# EAGLE design rectifier (EAGLE 5.12)
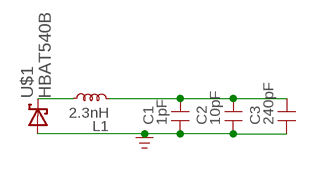
[diagram p0: schematic, sheet 1]

## Parts
C1  1pF  C-0805  [SMD0805]
C2  10pF  C-0805  [SMD0805]
C3  240pF  C-1210  [C1210]
L1  2.3nH  L-0402  [SMD0402]
U$1  HBAT540B  [SOT323]

## Nets
GND: C1.1 C2.1 C3.1 U$1.1(A)
N$1: L1.1 U$1.3(K)
N$2: C1.2 C2.2 C3.2 L1.2

## Library data of the parts
C1-C3 = c:C
L1 = l:L: Bournes SSR1806 Series From mouser: SRR1806-151M, 150uH, 1.05A, $0.85 Coiltronics DR127 Series From mouser: DR127-470-R, 47uH, 5.28A, $1.87 DR127-680-R, 68uH, 4.44A, $1.87 J.W. Miller 2300 Series From mouser: 2313, 120uH, 6.7A, $2.78
U$1 = siggen:HBAT540

## Board
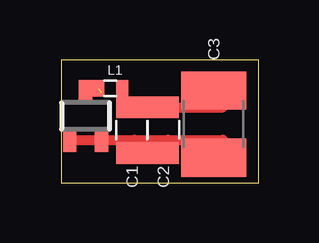
[diagram p1: board, top side]

Size 8.23 x 5.13 mm. Coordinates in mm from the lower left corner, seen from the top.
Outline: 0,0 8.23,0 8.23,5.13 0,5.13 0,0
Copper layers (1*16): Top 0.035mm / dielectric 1.5mm / Bottom 0.035mm
Design rules "default": minimum track width 10mil, minimum drill 24mil, track to track 8mil, track to pad 8mil, pad to pad 8mil, via to via 8mil, smd to smd 8mil, copper to edge 40mil, drill to drill 8mil, minimum pad ring 10mil, minimum via ring 8mil, stop-mask expansion 4mil, vias tented up to drill 0mil, thermal gap 10mil

### Footprints (pad centres in the part's own frame; a part is rotated, then mirrored left to right if it is on the bottom)
SMD0805 = smd 0.9 x 1.3: 1 -0.95,0; 2 0.95,0
C1210 = smd 1.6 x 2.7: 1 -1.4,0; 2 1.4,0
SMD0402 = smd 0.5 x 0.7: 1 0.5,0; 2 -0.5,0
SOT323 = smd 0.559 x 0.991: 1 -0.66,-1.003; 2 0.66,-1.003; 3 0,1.003

### Placement (x,y rotation side)
C1  2.95,2.2 90 top
C2  4.25,2.2 90 top
C3  6.35,2.45 90 top
L1  2.04,3.94 180 top
U$1  1.02,2.79 0 top

### Tracks (layer width: path | path; a pad name or v marks a point on that pad's centre or on a via)
GND
  Top 0.406: U$1.1 3.05,1.79 | 3.05,1.79 4.45,1.79 | 4.45,1.79 6.73,1.79 C3.1 | 4.45,1.79 C2.1 | C1.1 3.05,1.08 3.05,1.79
N$1  (1 unrouted)
  Top 0.254: U$1.3 1.52,3.8 L1.1
N$2
  Top 0.254: L1.2 2.66,3.24 C1.2
  Top 0.406: C2.2 C1.2 6.73,3.15 C3.2